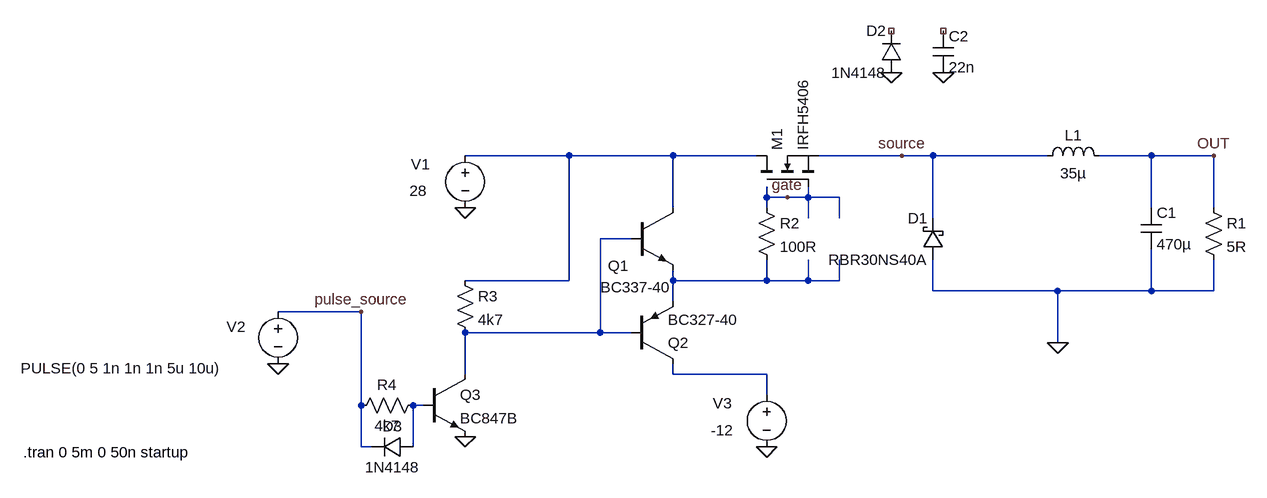
[diagram p0: schematic fan_smps.asc]
fan_smps.asc, the LTspice schematic file:
Version 4
SHEET 1 880 680
WIRE -352 32 -512 32
WIRE -192 32 -352 32
WIRE -64 32 -192 32
WIRE 160 32 32 32
WIRE 208 32 160 32
WIRE 384 32 208 32
WIRE 544 32 464 32
WIRE 640 32 544 32
WIRE -48 96 -48 80
WIRE -16 96 -48 96
WIRE 16 96 16 80
WIRE 16 96 -16 96
WIRE 64 96 16 96
WIRE -192 112 -192 32
WIRE -48 112 -48 96
WIRE 544 112 544 32
WIRE 640 112 640 32
WIRE 16 128 16 96
WIRE 64 128 64 96
WIRE 208 128 208 32
WIRE -256 160 -304 160
WIRE -352 224 -352 32
WIRE -352 224 -512 224
WIRE -192 224 -192 208
WIRE -48 224 -48 192
WIRE -48 224 -192 224
WIRE 16 224 16 192
WIRE 16 224 -48 224
WIRE 64 224 64 192
WIRE 64 224 16 224
WIRE 208 240 208 192
WIRE 400 240 208 240
WIRE 544 240 544 176
WIRE 544 240 400 240
WIRE 640 240 640 192
WIRE 640 240 544 240
WIRE -192 256 -192 224
WIRE -672 272 -800 272
WIRE -304 304 -304 160
WIRE -304 304 -512 304
WIRE -256 304 -304 304
WIRE 400 320 400 240
WIRE -512 368 -512 304
WIRE -192 368 -192 352
WIRE -48 368 -192 368
WIRE -48 400 -48 368
WIRE -672 416 -672 272
WIRE -576 416 -592 416
WIRE -672 480 -672 416
WIRE -656 480 -672 480
WIRE -592 480 -592 416
FLAG 400 320 0
FLAG -512 112 0
FLAG -800 352 0
FLAG -512 464 0
FLAG 640 32 OUT
FLAG -672 272 pulse_source
FLAG -16 96 gate
FLAG 224 -96 0
FLAG 144 -96 0
FLAG -48 480 0
FLAG 160 32 source
SYMBOL schottky 224 192 R180
WINDOW 0 24 64 Left 2
WINDOW 3 24 0 Left 2
SYMATTR InstName D1
SYMATTR Value RBR30NS40A
SYMBOL ind 368 48 R270
WINDOW 0 32 56 VTop 2
WINDOW 3 5 56 VBottom 2
SYMATTR InstName L1
SYMATTR Value 35µ
SYMBOL res 624 96 R0
SYMATTR InstName R1
SYMATTR Value 5R
SYMBOL cap 528 112 R0
SYMATTR InstName C1
SYMATTR Value 470µ
SYMBOL npn -256 112 R0
WINDOW 0 -36 89 Left 2
WINDOW 3 -48 122 Left 2
SYMATTR InstName Q1
SYMATTR Value BC337-40
SYMBOL pnp -256 352 M180
SYMATTR InstName Q2
SYMATTR Value BC327-40
SYMBOL res -64 96 R0
SYMATTR InstName R2
SYMATTR Value 100R
SYMBOL voltage -512 16 R0
WINDOW 0 -83 29 Left 2
WINDOW 3 -86 70 Left 2
WINDOW 123 0 0 Left 0
WINDOW 39 0 0 Left 0
SYMATTR InstName V1
SYMATTR Value 28
SYMBOL voltage -800 256 R0
WINDOW 0 -79 39 Left 2
WINDOW 3 -396 103 Left 2
WINDOW 123 0 0 Left 0
WINDOW 39 0 0 Left 0
SYMATTR InstName V2
SYMATTR Value PULSE(0 5 1n 1n 1n 5u 10u)
SYMBOL npn -576 368 R0
SYMATTR InstName Q3
SYMATTR Value BC847B
SYMBOL res -528 208 R0
SYMATTR InstName R3
SYMATTR Value 4k7
SYMBOL res -576 400 R90
WINDOW 0 0 56 VBottom 2
WINDOW 3 32 56 VTop 2
SYMATTR InstName R4
SYMATTR Value 4k7
SYMBOL diode 160 -96 R180
WINDOW 0 24 64 Left 2
WINDOW 3 24 0 Left 2
SYMATTR InstName D2
SYMATTR Value 1N4148
SYMBOL cap 208 -160 R0
SYMATTR InstName C2
SYMATTR Value 22n
SYMBOL diode -592 464 R90
WINDOW 0 0 32 VBottom 2
WINDOW 3 32 32 VTop 2
SYMATTR InstName D3
SYMATTR Value 1N4148
SYMBOL nmos -64 80 R270
SYMATTR InstName M1
SYMATTR Value IRFH5406
SYMBOL voltage -48 384 R0
WINDOW 0 -83 29 Left 2
WINDOW 3 -86 70 Left 2
WINDOW 123 0 0 Left 0
WINDOW 39 0 0 Left 0
SYMATTR InstName V3
SYMATTR Value -12
TEXT -1192 488 Left 2 !.tran 0 5m 0 50n startup

The netlist it stands for:
* fan_smps.asc
D1 0 source RBR30NS40A
L1 source OUT 35µ
R1 OUT 0 5R
C1 OUT 0 470µ
Q1 N001 N002 N003 0 BC337-40
Q2 N004 N002 N003 0 BC327-40
R2 gate N003 100R
V1 N001 0 28
V2 pulse_source 0 PULSE(0 5 1n 1n 1n 5u 10u)
Q3 N002 N005 0 0 BC847B
R3 N001 N002 4k7
R4 N005 pulse_source 4k7
D2 0 NC_01 1N4148
C2 NC_02 0 22n
D3 N005 pulse_source 1N4148
M1 N001 gate source source IRFH5406
V3 N004 0 -12
.model D D
.lib standard.dio
.model NPN NPN
.model PNP PNP
.lib standard.bjt
.model NMOS NMOS
.model PMOS PMOS
.lib standard.mos
.tran 0 5m 0 50n startup
.backanno
.end